# Altium project SIM7670G.PrjPcb
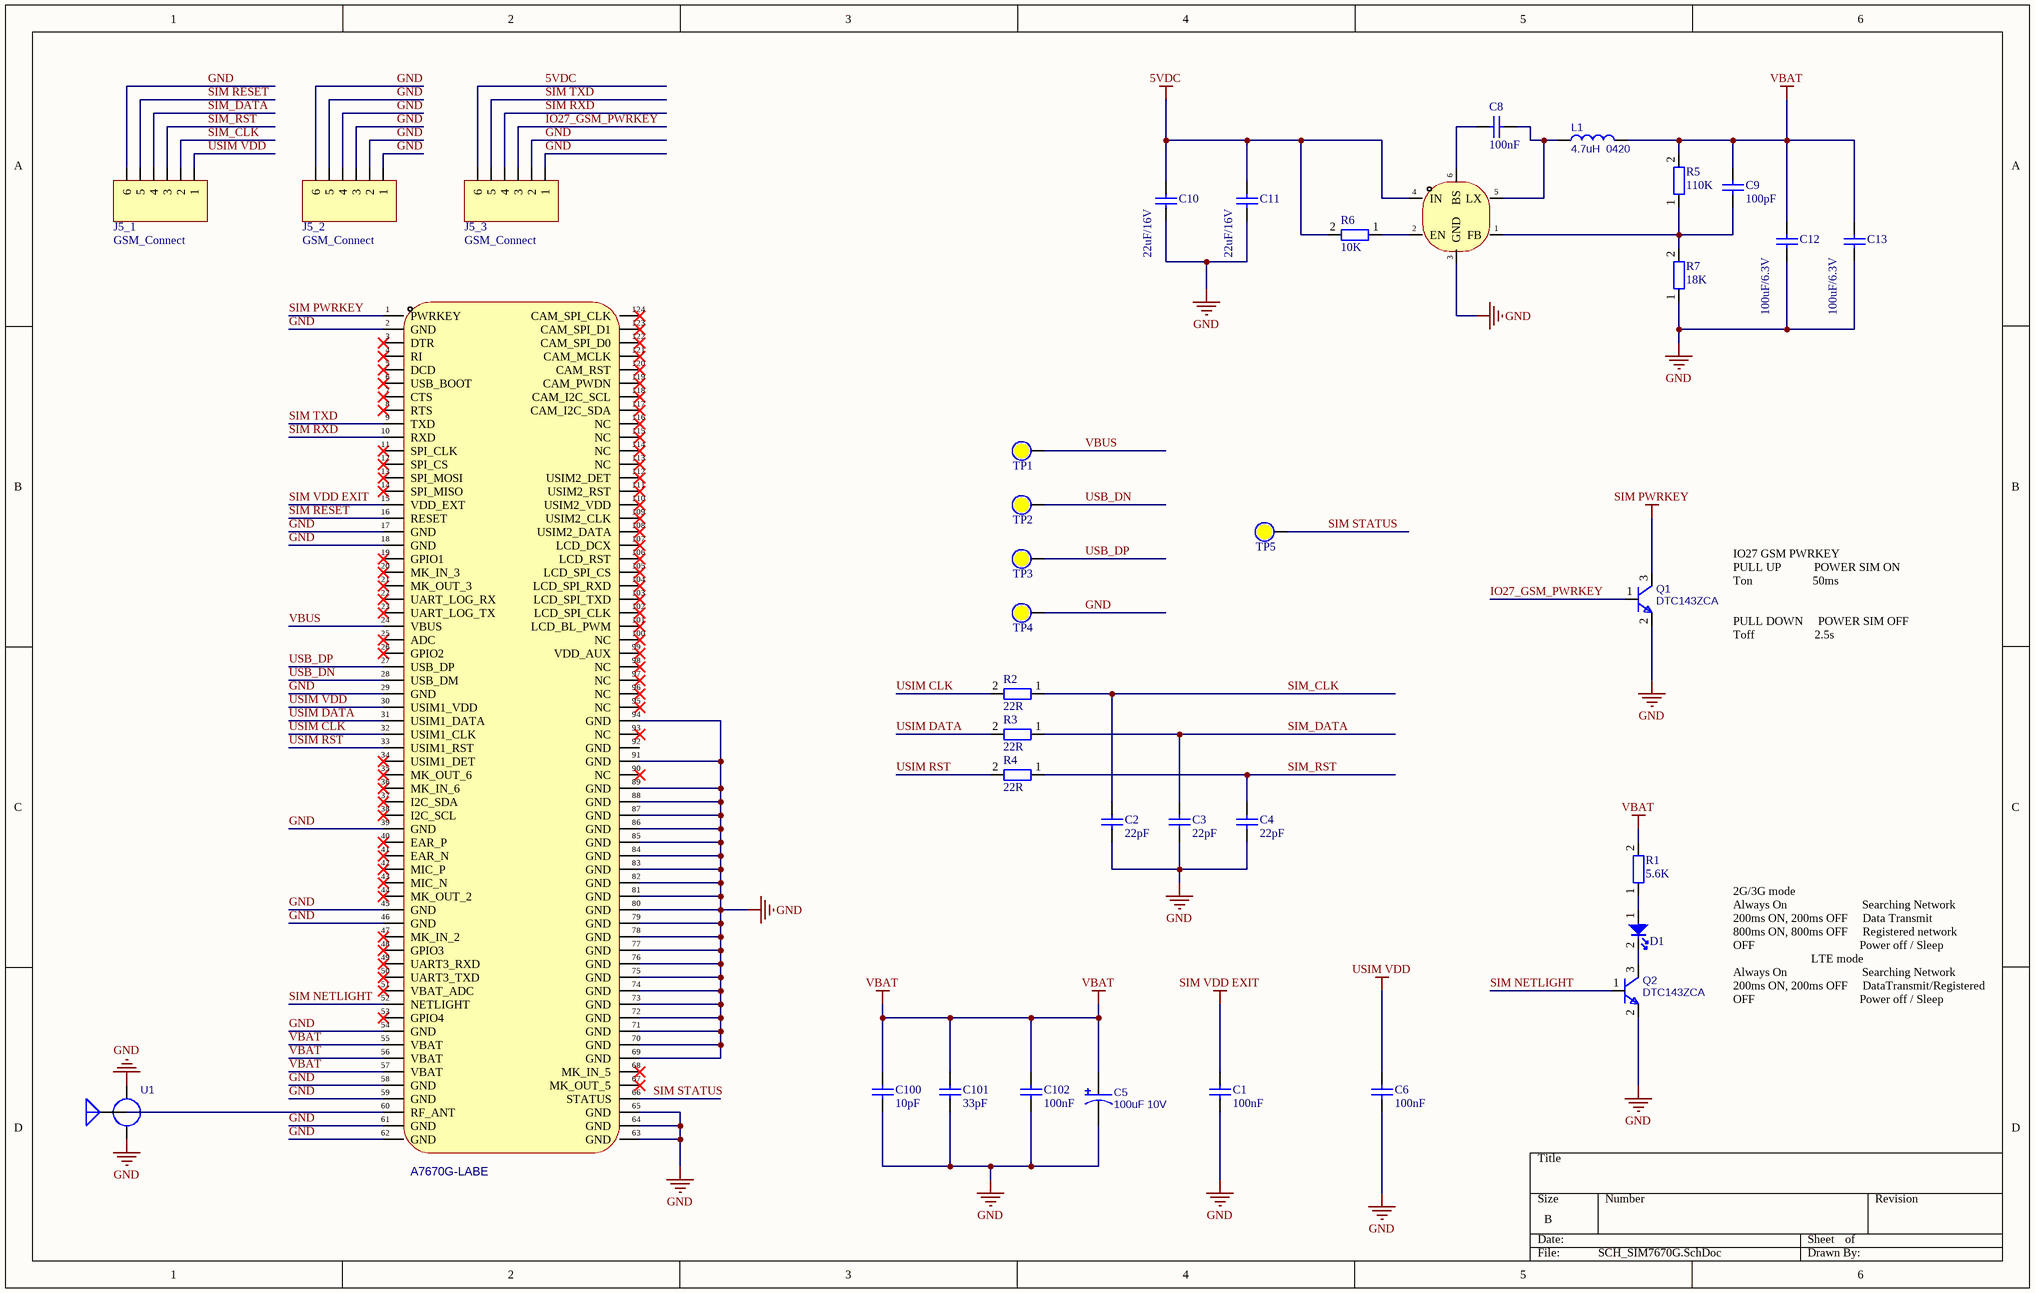
[diagram p0: SCH_SIM7670G.SchDoc]
1 sheet, 37 parts. Net scope: global (net labels, ports and power ports of the same name join across sheets).
Board file: PCB_SIM7670G.PcbDoc

## Sheet SCH_SIM7670G.SchDoc
size B; SheetNumber: 1; SheetTotal: 1

### Parts
C1  100nF  [CAP CERAMIC SMD 0402 TyPE 1005]
C2  22pF  [CAP CERAMIC SMD 0402 TyPE 1005]
C3  22pF  [CAP CERAMIC SMD 0402 TyPE 1005]
C4  22pF  [CAP CERAMIC SMD 0402 TyPE 1005]
C5  100uF 10V  [CAP TANTALUM SMD 3528-21 type B]
C6  100nF  [CAP CERAMIC SMD 0402 TyPE 1005]
C8  100nF  [CAP CERAMIC SMD 0402 TyPE 1005]
C9  100pF  [CAP CERAMIC SMD 0402 TyPE 1005]
C10  22uF/16V  [CAP CERAMIC SMD 0603 TyPE 1608]
C11  22uF/16V  [CAP CERAMIC SMD 0603 TyPE 1608]
C12  100uF/6.3V  [CAP CERAMIC SMD 1206 TyPE 3216]
C13  100uF/6.3V  [CAP CERAMIC SMD 1206 TyPE 3216]
C100  10pF  [CAP CERAMIC SMD 0402 TyPE 1005]
C101  33pF  [CAP CERAMIC SMD 0402 TyPE 1005]
C102  100nF  [CAP CERAMIC SMD 0402 TyPE 1005]
D1  LED  [LED SMD GREEN TYPE 0603]  (value not drawn)
J5_1  GSM_Connect  [CONNECTORS FEMALE HEADERS 1X6 2.0 TYPE STRAIGHT SMD]
J5_2  GSM_Connect  [CONNECTORS FEMALE HEADERS 1X6 2.0 TYPE STRAIGHT SMD]
J5_3  GSM_Connect  [CONNECTORS FEMALE HEADERS 1X6 2.0 TYPE STRAIGHT SMD]
L1  4.7uH  0420  [INDUCTORS SMD 0420]
Q1  DTC143ZCA  [SOT-23]
Q2  DTC143ZCA  [SOT-23]
R1  5.6K  [RES CHIPS SMD 0402 TYPE 1005]
R2  22R  [RES CHIPS SMD 0402 TYPE 1005]
R3  22R  [RES CHIPS SMD 0402 TYPE 1005]
R4  22R  [RES CHIPS SMD 0402 TYPE 1005]
R5  110K  [RES CHIPS SMD 0402 TYPE 1005]
R6  10K  [RES CHIPS SMD 0402 TYPE 1005]
R7  18K  [RES CHIPS SMD 0402 TYPE 1005]
TP1  (no value)  [TEST POINT 4]  (no BOM)
TP2  (no value)  [TEST POINT 4]  (no BOM)
TP3  (no value)  [TEST POINT 4]  (no BOM)
TP4  (no value)  [TEST POINT 4]  (no BOM)
TP5  (no value)  [TEST POINT 4]  (no BOM)
U1  (no value)  [CONNECTORS RF SMD TYPE IPEX]
U2  A7670G-LABE  [Modules SIM7670G]
U3  SY8105IADC  [SOT-23-6]  (value not drawn)

### Nets
5VDC: C10.2 C11.2 J5_3.6 R6.2 U3.4(IN)
GND: C1.1 C2.2 C3.1 C4.1 C5.2 C6.1 C10.1 C11.1 C12.1 C13.1 C100.1 C101.1 C102.1 J5_1.6 J5_2.1 J5_2.2 J5_2.3 J5_2.4 J5_2.5 J5_2.6 J5_3.1 J5_3.2 Q1.2(E) Q2.2(E) R7.1 TP4.0 U1.2 U1.3 U2.2(GND) U2.17(GND) U2.18(GND) U2.29(GND) U2.39(GND) U2.45(GND) U2.46(GND) U2.54(GND) U2.58(GND) U2.59(GND) U2.61(GND) U2.62(GND) U2.63(GND) U2.64(GND) U2.65(GND) U2.69(GND) U2.70(GND) U2.71(GND) U2.72(GND) U2.73(GND) U2.74(GND) U2.75(GND) U2.76(GND) U2.77(GND) U2.78(GND) U2.79(GND) U2.80(GND) U2.81(GND) U2.82(GND) U2.83(GND) U2.84(GND) U2.85(GND) U2.86(GND) U2.87(GND) U2.88(GND) U2.89(GND) U2.91(GND) U2.94(GND) U3.3(GND)
SIM PWRKEY: Q1.3(C) U2.1(PWRKEY)
SIM VDD EXIT: C1.2 U2.15(VDD_EXT)
USIM VDD: C6.2 J5_1.1 U2.30(USIM1_VDD)
VBAT: C5.1 C9.2 C12.2 C13.2 C100.2 C101.2 C102.2 L1.2 R1.2 R5.2 U2.55(VBAT) U2.56(VBAT) U2.57(VBAT)
IO27_GSM_PWRKEY: J5_3.3 Q1.1(B)
SIM NETLIGHT: Q2.1(B) U2.52(NETLIGHT)
SIM RESET: J5_1.5 U2.16(RESET)
SIM RXD: J5_3.4 U2.10(RXD)
SIM STATUS: TP5.0 U2.66(STATUS)
SIM TXD: J5_3.5 U2.9(TXD)
SIM_CLK: C2.1 J5_1.2 R2.1
SIM_DATA: C3.2 J5_1.4 R3.1
SIM_RST: C4.2 J5_1.3 R4.1
USB_DN: TP2.0 U2.28(USB_DM)
USB_DP: TP3.0 U2.27(USB_DP)
USIM CLK: R2.2 U2.32(USIM1_CLK)
USIM DATA: R3.2 U2.31(USIM1_DATA)
USIM RST: R4.2 U2.33(USIM1_RST)
VBUS: TP1.0 U2.24(VBUS)
NetC8_1: C8.1 L1.1 U3.5(LX)
NetC8_2: C8.2 U3.6(BS)
NetC9_1: C9.1 R5.1 R7.2 U3.1(FB)
NetD1_1: D1.1 R1.1
NetD1_2: D1.2 Q2.3(C)
NetR6_1: R6.1 U3.2(EN)
NetU1_1: U1.1 U2.60(RF_ANT)

Not connected (* = marked no-connect by the designer): U2 3(DTR)* 4(RI)* 5(DCD)* 6(USB_BOOT)* 7(CTS)* 8(RTS)* 11(SPI_CLK)* 12(SPI_CS)* 13(SPI_MOSI)* 14(SPI_MISO)* 19(GPIO1)* 20(MK_IN_3)* 21(MK_OUT_3)* 22(UART_LOG_RX)* 23(UART_LOG_TX)* 25(ADC)* 26(GPIO2)* 34(USIM1_DET)* 35(MK_OUT_6)* 36(MK_IN_6)* 37(I2C_SDA)* 38(I2C_SCL)* 40(EAR_P)* 41(EAR_N)* 42(MIC_P)* 43(MIC_N)* 44(MK_OUT_2)* 47(MK_IN_2)* 48(GPIO3)* 49(UART3_RXD)* 50(UART3_TXD)* 51(VBAT_ADC)* 53(GPIO4)* 67(MK_OUT_5)* 68(MK_IN_5)* 90(NC)* 92(GND) 93(NC)* 95(NC)* 96(NC)* 97(NC)* 98(NC)* 99(VDD_AUX)* 100(NC)* 101(LCD_BL_PWM)* 102(LCD_SPI_CLK)* 103(LCD_SPI_TXD)* 104(LCD_SPI_RXD)* 105(LCD_SPI_CS)* 106(LCD_RST)* 107(LCD_DCX)* 108(USIM2_DATA)* 109(USIM2_CLK)* 110(USIM2_VDD)* 111(USIM2_RST)* 112(USIM2_DET)* 113(NC)* 114(NC)* 115(NC)* 116(NC)* 117(CAM_I2C_SDA)* 118(CAM_I2C_SCL)* 119(CAM_PWDN)* 120(CAM_RST)* 121(CAM_MCLK)* 122(CAM_SPI_D0)* 123(CAM_SPI_D1)* 124(CAM_SPI_CLK)*

### Notes on the sheet
- IO27 GSM PWRKEY
  PULL UP           POWER SIM ON
  Ton                    50ms
  PULL DOWN     POWER SIM OFF
  Toff                    2.5s
- 2G/3G mode
  Always On                         Searching Network
  200ms ON, 200ms OFF     Data Transmit
  800ms ON, 800ms OFF     Registered network
  OFF                                   Power off / Sleep
  LTE mode
  Always On                         Searching Network
  200ms ON, 200ms OFF     DataTransmit/Registered
  OFF                                   Power off / Sleep

### Library data of the parts
C1 C6 C8 C102 = CAP104-100nF-50V: Capacitor; 104: 100nF
C2-C4 C9-C13 C100 C101 = CAP104-100nF-50V: Capacitor; 104: 100nF
C5 = CAP ALU HOLD: Aluminum Electrolytic Capacitors - Leaded ROHS; BOM_Manufacturer: AISHI(艾华集团); BOM_Manufacturer Part: ERR1VM102G20OT; nameAlias: Capacitance; Contributor: LCSC; BOM_Supplier: LCSC; BOM_Supplier Part: C398835; BOM_JLCPCB Part Class: Extended Part; spicePre: C; spiceSymbolName: ERR1VM102G20OT
D1 = LED SMD 0805: Emerald 0805 Light Emitting Diodes (LED) ROHS; Supplier 1: RSComponents
J5_1-J5_3 = JP 1x6 2.54 Duc Thang: Cắm; Ten_Linh_Kien: Jump Đơn Đực 2.54MM 1x40P Thẳng 11MM; Don_Vi: Con; Ma_Hang: MH000903; Ghi_Chu: *; Kieu_Chan: *; Chung_Loai: Cắm
L1 = INDUCTORS SMD: BOM_Manufacturer: Yanchuang(研创); BOM_Manufacturer Part: SCHF160808H47NJT; nameAlias: Inductance; Contributor: LCSC; BOM_Supplier: LCSC; BOM_Supplier Part: C578001; BOM_JLCPCB Part Class: Extended Part; spicePre: L; spiceSymbolName: SCHF160808H47NJT
Q1 Q2 = TRANSISTOR SMD NPN: SOT-23 Bipolar Transistors npn - BJT ROHS; BOM_Manufacturer: 晶扬电子; BOM_Manufacturer Part: MMBT3904; Contributor: lcsc; BOM_Supplier: LCSC; BOM_Supplier Part: C5156716; link: https://atta.szlcsc.com/upload/public/pdf/source/20220916/F7F78DEEB551E1B14C8EDDE9CBB3CED9.pdf; spicePre: Q; spiceSymbolName: MMBT3904_C5156716
R1-R7 = RES 0603 1%_: ±1% - Chip Resistor - Surface Mount ROHS; Chung_Loai: Dán; Don_Vi: Con; So_Chan: 2; Ma_Hang: MH005880; Kieu_Chan: *
TP1-TP5 = TEST POINT: Solder: NF
U1 = CONNECTORS RF SMD: SMD RF Connectors / Coaxial Connectors ROHS; BOM_Manufacturer: SHOU HAN(首韩); BOM_Manufacturer Part: IPEX1-TXZ 142; Contributor: lcsc; BOM_Supplier: LCSC; BOM_Supplier Part: C3151745; link: https://atta.szlcsc.com/upload/public/pdf/source/20220627/A0C2EF411B6F3EC53ED1A4F491E26EB6.pdf; BOM_JLCPCB Part Class: Extended Part; spicePre: U; spiceSymbolName: IPEX1-TXZ 142
U2 = MODULES SIM A7670G-LABE: Manufacturer: SIMCOM(芯讯通无线科技); Add into BOM: yes; Symbol: A7670G-LABE; Device: A7670G-LABE; LCSC Part Name: A7670G-LABE; Supplier Part: C22462360; Manufacturer Part: A7670G-LABE; Supplier Footprint: SMD,24x24mm; JLCPCB Part Class: Extended Part; Datasheet: https://atta.szlcsc.com/upload/public/pdf/source/20240607/B50C584620D03E126C7F7E827627A461.pdf; Supplier: LCSC; Convert to PCB: yes
U3 = SY8105IADC: Manufacturer: silergy(矽力杰); Add into BOM: yes; Function: Step-down type; Input Voltage: 4.5V~18V; Switching Frequency: 500kHz; Number of Outputs: 1; Topology: Step-down; Quiescent Current (Iq): 250uA; Switch tube (built-in/external): Built-in; Symbol: SY8105IADC; Device: SY8105IADC; LCSC Part Name: 高效率快速响应5.0A 18V输入同步降压调节器; Supplier Part: C2981547; Manufacturer Part: SY8105IADC; Supplier Footprint: TSOT-23-6; JLCPCB Part Class: Extended Part; Datasheet: https://atta.szlcsc.com/upload/public/pdf/source/20220309/7BF3C8E5C307C2252A511902A6824332.pdf; Supplier: LCSC; Convert to PCB: yes; Output Type: -; Output Voltage: -; Output Current: -; Operating Temperature: -40℃~+125℃; Synchronous Rectification: Yes